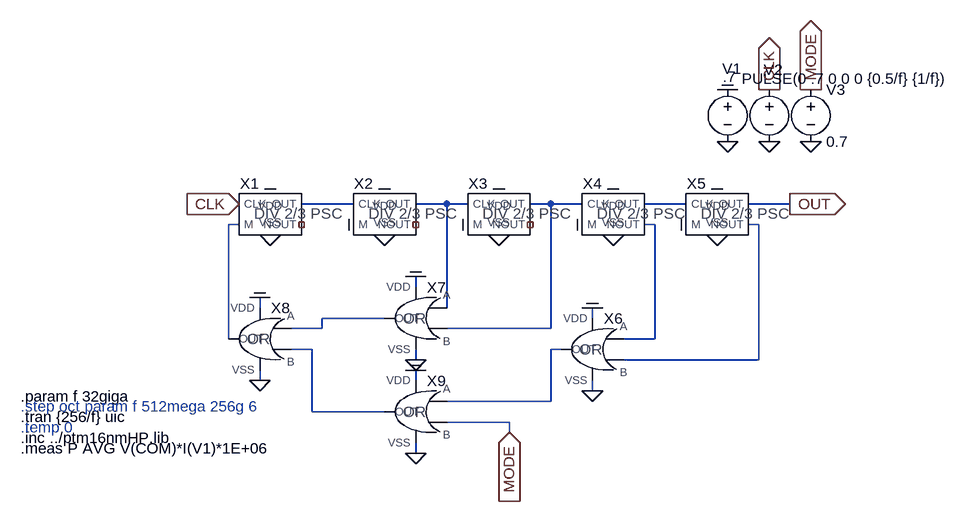
[diagram p0: schematic Full_Design.asc]
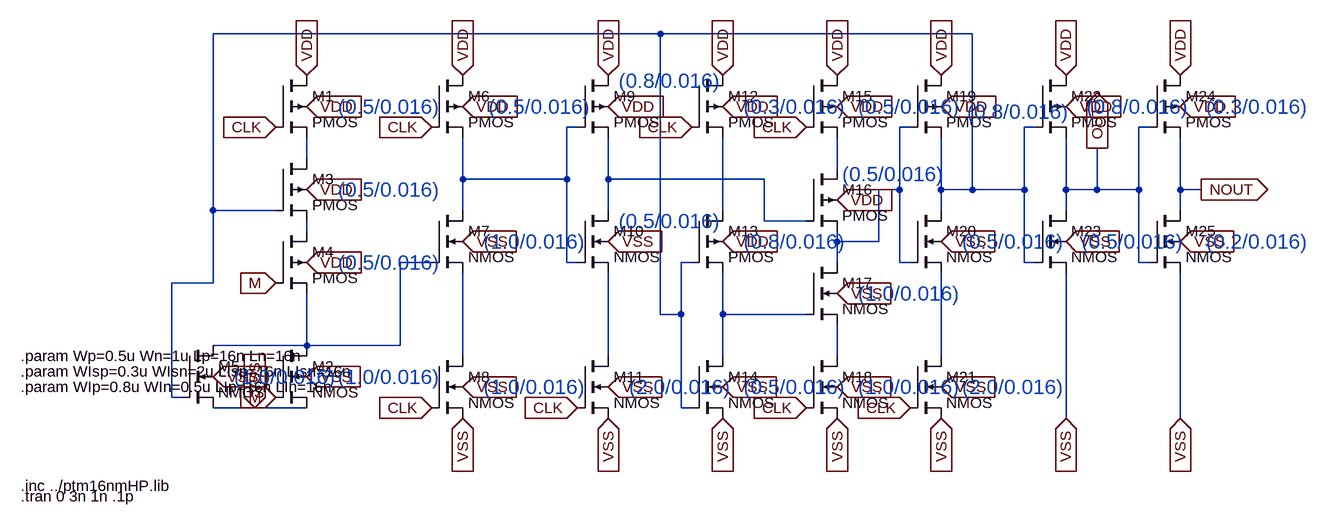
[diagram p1: sub-circuit tspc_33ghz_2by3psc.asc]
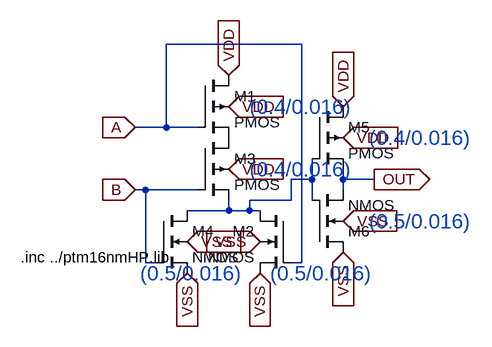
[diagram p2: sub-circuit logic_or_ccmos.asc]
Full_Design.asc, the LTspice schematic file:
Version 4
SHEET 1 1024 764
WIRE 160 80 80 80
WIRE 304 80 256 80
WIRE 336 80 304 80
WIRE 464 80 432 80
WIRE 512 80 464 80
WIRE 672 80 608 80
WIRE 832 80 768 80
WIRE -16 112 -32 112
WIRE 624 112 608 112
WIRE 784 112 768 112
WIRE 256 208 256 192
WIRE 16 240 16 224
WIRE 304 240 304 80
WIRE 208 256 112 256
WIRE 528 256 528 240
WIRE 112 272 112 256
WIRE 112 272 64 272
WIRE 464 272 464 80
WIRE 464 272 304 272
WIRE -32 288 -32 112
WIRE 624 288 624 112
WIRE 624 288 576 288
WIRE 96 304 64 304
WIRE 480 304 464 304
WIRE 256 320 256 304
WIRE 784 320 784 112
WIRE 784 320 576 320
WIRE 16 352 16 336
WIRE 256 352 256 336
WIRE 528 368 528 352
WIRE 464 384 464 304
WIRE 464 384 304 384
WIRE 96 400 96 304
WIRE 208 400 96 400
WIRE 400 416 304 416
WIRE 400 432 400 416
WIRE 256 464 256 448
FLAG 736 -16 0
FLAG 800 -16 0
FLAG 736 -96 COM
FLAG 32 64 COM
FLAG 208 64 COM
FLAG 384 64 COM
FLAG 32 128 0
FLAG 208 128 0
FLAG 384 128 0
FLAG -16 80 CLK
IOPIN -16 80 In
FLAG 800 -96 CLK
IOPIN 800 -96 Out
FLAG 560 128 0
FLAG 720 128 0
FLAG 672 112 COM
FLAG 560 64 COM
FLAG 720 64 COM
FLAG 512 112 COM
FLAG 336 112 COM
FLAG 160 112 COM
FLAG 832 80 OUT
IOPIN 832 80 Out
FLAG 864 -16 0
FLAG 864 -96 MODE
IOPIN 864 -96 Out
FLAG 256 192 COM
FLAG 16 224 COM
FLAG 528 240 COM
FLAG 256 336 COM
FLAG 16 352 0
FLAG 256 320 0
FLAG 528 368 0
FLAG 256 464 0
FLAG 400 432 MODE
IOPIN 400 432 In
SYMBOL TSPC_33GHz_2by3PSC 32 96 R0
SYMATTR InstName X1
SYMBOL TSPC_33GHz_2by3PSC 208 96 R0
SYMATTR InstName X2
SYMBOL TSPC_33GHz_2by3PSC 384 96 R0
SYMATTR InstName X3
SYMBOL voltage 736 -112 R0
WINDOW 0 -8 -16 Left 2
WINDOW 3 -7 -4 Left 2
SYMATTR InstName V1
SYMATTR Value .7
SYMBOL voltage 800 -112 R0
WINDOW 0 -8 -15 Left 2
WINDOW 3 -42 -1 Left 2
WINDOW 123 0 0 Left 0
WINDOW 39 0 0 Left 0
SYMATTR InstName V2
SYMATTR Value PULSE(0 .7 0 0 0 {0.5/f} {1/f})
SYMBOL TSPC_33GHz_2by3PSC 560 96 R0
SYMATTR InstName X4
SYMBOL TSPC_33GHz_2by3PSC 720 96 R0
SYMATTR InstName X5
SYMBOL voltage 864 -112 R0
SYMATTR InstName V3
SYMATTR Value 0.7
SYMBOL LOGIC_OR_cCMOS 544 304 M0
SYMATTR InstName X6
SYMBOL LOGIC_OR_cCMOS 272 256 M0
SYMATTR InstName X7
SYMBOL LOGIC_OR_cCMOS 32 288 M0
SYMATTR InstName X8
SYMBOL LOGIC_OR_cCMOS 272 400 M0
SYMATTR InstName X9
TEXT -352 440 Left 2 !.inc ../ptm16nmHP.lib
TEXT -352 408 Left 2 !.tran {256/f} uic
TEXT -352 424 Left 2 ;.temp 0
TEXT -352 376 Left 2 !.param f 32giga
TEXT -352 456 Left 2 !.meas P AVG V(COM)*I(V1)*1E+06
TEXT -352 392 Left 2 ;.step oct param f 512mega 256g 6

tspc_33ghz_2by3psc.asc, the sub-circuit schematic file:
Version 4
SHEET 1 1996 904
WIRE 752 -16 64 -16
WIRE 1232 -16 752 -16
WIRE 624 128 608 128
WIRE 1136 128 1120 128
WIRE 1328 128 1312 128
WIRE 1504 128 1488 128
WIRE 208 176 208 144
WIRE 1024 192 1024 144
WIRE 448 208 448 144
WIRE 608 208 608 128
WIRE 608 208 448 208
WIRE 672 208 672 144
WIRE 912 208 672 208
WIRE 1120 224 1120 128
WIRE 1120 224 1088 224
WIRE 1184 224 1184 144
WIRE 1232 224 1232 -16
WIRE 1232 224 1184 224
WIRE 1312 224 1312 128
WIRE 1312 224 1232 224
WIRE 1376 224 1376 144
WIRE 1424 224 1424 160
WIRE 1424 224 1376 224
WIRE 1488 224 1488 128
WIRE 1488 224 1424 224
WIRE 1552 224 1552 144
WIRE 1584 224 1552 224
WIRE 64 256 64 -16
WIRE 160 256 64 256
WIRE 448 256 448 208
WIRE 672 256 672 208
WIRE 848 256 848 144
WIRE 1184 256 1184 224
WIRE 1376 256 1376 224
WIRE 1552 256 1552 224
WIRE 912 272 912 208
WIRE 976 272 912 272
WIRE 208 288 208 272
WIRE 1024 304 1024 288
WIRE 1088 304 1088 224
WIRE 1088 304 1024 304
WIRE 400 336 352 336
WIRE 608 336 608 208
WIRE 624 336 608 336
WIRE 800 336 784 336
WIRE 1024 336 1024 304
WIRE 1120 336 1120 224
WIRE 1136 336 1120 336
WIRE 1312 336 1312 224
WIRE 1328 336 1312 336
WIRE 1488 336 1488 224
WIRE 1504 336 1488 336
WIRE 64 368 64 256
WIRE 64 368 0 368
WIRE 752 416 752 -16
WIRE 784 416 784 336
WIRE 784 416 752 416
WIRE 848 416 848 352
WIRE 976 416 848 416
WIRE 208 464 208 384
WIRE 208 464 64 464
WIRE 352 464 352 336
WIRE 352 464 208 464
WIRE 448 480 448 352
WIRE 672 480 672 352
WIRE 848 480 848 416
WIRE 1024 480 1024 432
WIRE 1184 480 1184 352
WIRE 0 544 0 368
WIRE 16 544 0 544
WIRE 128 560 64 560
WIRE 208 560 128 560
WIRE 784 560 784 416
WIRE 800 560 784 560
WIRE 1376 576 1376 352
WIRE 1552 576 1552 352
FLAG 208 96 VDD
IOPIN 208 96 In
FLAG 208 512 VSS
IOPIN 208 512 In
FLAG 208 48 VDD
IOPIN 208 48 In
FLAG 208 224 VDD
IOPIN 208 224 In
FLAG 208 336 VDD
IOPIN 208 336 In
FLAG 64 512 VSS
IOPIN 64 512 In
FLAG 448 96 VDD
IOPIN 448 96 In
FLAG 448 48 VDD
IOPIN 448 48 In
FLAG 448 304 VSS
IOPIN 448 304 In
FLAG 448 528 VSS
IOPIN 448 528 In
FLAG 672 96 VDD
IOPIN 672 96 In
FLAG 672 48 VDD
IOPIN 672 48 In
FLAG 672 304 VSS
IOPIN 672 304 In
FLAG 672 528 VSS
IOPIN 672 528 In
FLAG 848 96 VDD
IOPIN 848 96 In
FLAG 848 48 VDD
IOPIN 848 48 In
FLAG 848 304 VDD
IOPIN 848 304 In
FLAG 848 528 VSS
IOPIN 848 528 In
FLAG 1024 96 VDD
IOPIN 1024 96 In
FLAG 1024 48 VDD
IOPIN 1024 48 In
FLAG 1024 240 VDD
IOPIN 1024 240 In
FLAG 1024 384 VSS
IOPIN 1024 384 In
FLAG 1024 528 VSS
IOPIN 1024 528 In
FLAG 1184 96 VDD
IOPIN 1184 96 In
FLAG 1184 48 VDD
IOPIN 1184 48 In
FLAG 1184 304 VSS
IOPIN 1184 304 In
FLAG 1184 528 VSS
IOPIN 1184 528 In
FLAG 128 560 VSS
IOPIN 128 560 In
FLAG 448 576 VSS
IOPIN 448 576 In
FLAG 672 576 VSS
IOPIN 672 576 In
FLAG 848 576 VSS
IOPIN 848 576 In
FLAG 1024 576 VSS
IOPIN 1024 576 In
FLAG 1184 576 VSS
IOPIN 1184 576 In
FLAG 624 560 CLK
IOPIN 624 560 In
FLAG 800 128 CLK
IOPIN 800 128 In
FLAG 976 128 CLK
IOPIN 976 128 In
FLAG 976 560 CLK
IOPIN 976 560 In
FLAG 1136 560 CLK
IOPIN 1136 560 In
FLAG 400 128 CLK
IOPIN 400 128 In
FLAG 400 560 CLK
IOPIN 400 560 In
FLAG 160 128 CLK
IOPIN 160 128 In
FLAG 160 368 M
IOPIN 160 368 In
FLAG 160 544 M
IOPIN 160 544 In
FLAG 1376 96 VDD
IOPIN 1376 96 In
FLAG 1376 48 VDD
IOPIN 1376 48 In
FLAG 1376 304 VSS
IOPIN 1376 304 In
FLAG 1376 576 VSS
IOPIN 1376 576 In
FLAG 1424 160 OUT
IOPIN 1424 160 Out
FLAG 1552 96 VDD
IOPIN 1552 96 In
FLAG 1552 304 VSS
IOPIN 1552 304 In
FLAG 1584 224 NOUT
IOPIN 1584 224 Out
FLAG 1552 576 VSS
IOPIN 1552 576 In
FLAG 1552 48 VDD
IOPIN 1552 48 In
SYMBOL pmos4 160 48 R0
SYMATTR InstName M1
SYMATTR Value2 l={Lp} w={Wp}
SYMBOL nmos4 160 464 R0
SYMATTR InstName M2
SYMATTR Value2 l={Ln} w={Wn}
SYMBOL pmos4 160 176 R0
SYMATTR InstName M3
SYMATTR Value2 l={Lp} w={Wp}
SYMBOL pmos4 160 288 R0
SYMATTR InstName M4
SYMATTR Value2 l={Lp} w={Wp}
SYMBOL nmos4 16 464 R0
SYMATTR InstName M5
SYMATTR Value2 l={Ln} w={Wn}
SYMBOL pmos4 400 48 R0
SYMATTR InstName M6
SYMATTR Value2 l={Lp} w={Wp}
SYMBOL nmos4 400 256 R0
SYMATTR InstName M7
SYMATTR Value2 l={Ln} w={Wn}
SYMBOL nmos4 400 480 R0
SYMATTR InstName M8
SYMATTR Value2 l={Ln} w={Wn}
SYMBOL pmos4 624 48 R0
SYMATTR InstName M9
SYMATTR Value2 l={LIp} w={WIp}
SYMBOL nmos4 624 256 R0
SYMATTR InstName M10
SYMATTR Value2 l={LIn} w={WIn}
SYMBOL nmos4 624 480 R0
SYMATTR InstName M11
SYMATTR Value2 l={LIsn} w={WIsn}
SYMBOL pmos4 800 48 R0
SYMATTR InstName M12
SYMATTR Value2 l={LIsp} w={WIsp}
SYMBOL pmos4 800 256 R0
SYMATTR InstName M13
SYMATTR Value2 l={LIp} w={WIp}
SYMBOL nmos4 800 480 R0
SYMATTR InstName M14
SYMATTR Value2 l={LIn} w={WIn}
SYMBOL pmos4 976 48 R0
SYMATTR InstName M15
SYMATTR Value2 l={Lp} w={Wp}
SYMBOL pmos4 976 192 R0
SYMATTR InstName M16
SYMATTR Value2 l={Lp} w={Wp}
SYMBOL nmos4 976 336 R0
SYMATTR InstName M17
SYMATTR Value2 l={Ln} w={Wn}
SYMBOL nmos4 976 480 R0
SYMATTR InstName M18
SYMATTR Value2 l={Ln} w={Wn}
SYMBOL pmos4 1136 48 R0
SYMATTR InstName M19
SYMATTR Value2 l={LIp} w={WIp}
SYMBOL nmos4 1136 256 R0
SYMATTR InstName M20
SYMATTR Value2 l={LIn} w={WIn}
SYMBOL nmos4 1136 480 R0
SYMATTR InstName M21
SYMATTR Value2 l={LIsn} w={WIsn}
SYMBOL pmos4 1328 48 R0
SYMATTR InstName M22
SYMATTR Value2 l={LIp} w={WIp}
SYMBOL nmos4 1328 256 R0
SYMATTR InstName M23
SYMATTR Value2 l={LIn} w={WIn}
SYMBOL pmos4 1504 48 R0
SYMATTR InstName M24
SYMATTR Value2 l={LIp} w=0.3u
SYMBOL nmos4 1504 256 R0
SYMATTR InstName M25
SYMATTR Value2 l={LIn} w=0.2u
TEXT -232 680 Left 2 !.inc ../ptm16nmHP.lib
TEXT -232 480 Left 2 !.param Wp=0.5u Wn=1u Lp=16n Ln=16n
TEXT -232 504 Left 2 !.param WIsp=0.3u WIsn=2u LIsp=16n LIsn=16n
TEXT -232 528 Left 2 !.param WIp=0.8u WIn=0.5u LIp=16n LIn=16n
TEXT -232 696 Left 2 !.tran 0 3n 1n .1p
TEXT 256 96 Left 3 ;(0.5/0.016)
TEXT 256 224 Left 3 ;(0.5/0.016)
TEXT 256 336 Left 3 ;(0.5/0.016)
TEXT 256 512 Left 3 ;(1.0/0.016)
TEXT 96 512 Left 3 ;(1.0/0.016)
TEXT 488 96 Left 3 ;(0.5/0.016)
TEXT 688 56 Left 3 ;(0.8/0.016)
TEXT 688 272 Left 3 ;(0.5/0.016)
TEXT 704 528 Left 3 ;(2.0/0.016)
TEXT 880 528 Left 3 ;(0.5/0.016)
TEXT 880 304 Left 3 ;(0.8/0.016)
TEXT 880 96 Left 3 ;(0.3/0.016)
TEXT 1056 96 Left 3 ;(0.5/0.016)
TEXT 1032 200 Left 3 ;(0.5/0.016)
TEXT 1056 528 Left 3 ;(1.0/0.016)
TEXT 1216 528 Left 3 ;(2.0/0.016)
TEXT 1216 304 Left 3 ;(0.5/0.016)
TEXT 1224 104 Left 3 ;(0.8/0.016)
TEXT 1400 304 Left 3 ;(0.5/0.016)
TEXT 1592 304 Left 3 ;(0.2/0.016)
TEXT 1592 96 Left 3 ;(0.3/0.016)
TEXT 480 528 Left 3 ;(1.0/0.016)
TEXT 480 304 Left 3 ;(1.0/0.016)
TEXT 1056 384 Left 3 ;(1.0/0.016)
TEXT 1408 96 Left 3 ;(0.8/0.016)

logic_or_ccmos.asc, the sub-circuit schematic file:
Version 4
SHEET 1 880 680
WIRE 240 -32 32 -32
WIRE 32 96 32 -32
WIRE 32 96 -16 96
WIRE 80 96 32 96
WIRE 256 176 256 144
WIRE 256 176 224 176
WIRE 304 176 304 160
WIRE 352 176 304 176
WIRE 0 192 -16 192
WIRE 80 192 0 192
WIRE 304 192 304 176
WIRE 224 208 224 176
WIRE 224 208 160 208
WIRE 256 208 256 176
WIRE 128 224 128 208
WIRE 128 224 64 224
WIRE 160 224 160 208
WIRE 160 224 128 224
WIRE 176 224 160 224
WIRE 0 304 0 192
WIRE 16 304 0 304
WIRE 240 304 240 -32
WIRE 240 304 224 304
FLAG 128 16 VDD
IOPIN 128 16 In
FLAG 128 64 VDD
IOPIN 128 64 In
FLAG 128 160 VDD
IOPIN 128 160 In
FLAG 176 272 VSS
IOPIN 176 272 In
FLAG 64 272 VSS
IOPIN 64 272 In
FLAG 64 320 VSS
IOPIN 64 320 In
FLAG 176 320 VSS
IOPIN 176 320 In
FLAG -16 96 A
IOPIN -16 96 In
FLAG -16 192 B
IOPIN -16 192 In
FLAG 352 176 OUT
IOPIN 352 176 Out
FLAG 304 64 VDD
IOPIN 304 64 In
FLAG 304 112 VDD
IOPIN 304 112 In
FLAG 304 240 VSS
IOPIN 304 240 In
FLAG 304 288 VSS
IOPIN 304 288 In
SYMBOL pmos4 80 16 R0
SYMATTR InstName M1
SYMATTR Value2 l=16n w=400n
SYMBOL nmos4 224 224 M0
SYMATTR InstName M2
SYMATTR Value2 l=16n w=500n
SYMBOL pmos4 80 112 R0
SYMATTR InstName M3
SYMATTR Value2 l=16n w=400n
SYMBOL nmos4 16 224 R0
SYMATTR InstName M4
SYMATTR Value2 l=16n w=500n
SYMBOL pmos4 256 64 R0
SYMATTR InstName M5
SYMATTR Value2 l=16n w=400n
SYMBOL nmos4 256 288 M180
SYMATTR InstName M6
SYMATTR Value2 l=16n w=500n
TEXT -192 296 Left 2 !.inc ../ptm16nmHP.lib
TEXT 160 64 Left 3 ;(0.4/0.016)
TEXT 160 160 Left 3 ;(0.4/0.016)
TEXT 344 112 Left 3 ;(0.4/0.016)
TEXT 344 240 Left 3 ;(0.5/0.016)
TEXT -8 320 Left 3 ;(0.5/0.016)
TEXT 192 320 Left 3 ;(0.5/0.016)

The netlist it stands for:
* Full_Design.asc
XX1 CLK N005 COM 0 N001 NC_01 tspc_33ghz_2by3psc
XX2 N001 COM COM 0 N002 NC_02 tspc_33ghz_2by3psc
XX3 N002 COM COM 0 N003 NC_03 tspc_33ghz_2by3psc
V1 COM 0 .7
V2 CLK 0 PULSE(0 .7 0 0 0 {0.5/f} {1/f})
XX4 N003 COM COM 0 N004 N006 tspc_33ghz_2by3psc
XX5 N004 COM COM 0 OUT N007 tspc_33ghz_2by3psc
V3 MODE 0 0.7
XX6 N006 N007 COM 0 N010 logic_or_ccmos
XX7 N002 N003 COM 0 N008 logic_or_ccmos
XX8 N008 N009 COM 0 N005 logic_or_ccmos
XX9 N010 MODE COM 0 N009 logic_or_ccmos

* block symbol definitions
.subckt tspc_33ghz_2by3psc CLK M VDD VSS OUT NOUT
M1 VDD CLK N004 VDD PMOS l={Lp} w={Wp}
M2 N009 M VSS VSS NMOS l={Ln} w={Wn}
M3 N004 N001 N008 VDD PMOS l={Lp} w={Wp}
M4 N008 M N009 VDD PMOS l={Lp} w={Wp}
M5 N009 N001 VSS VSS NMOS l={Ln} w={Wn}
M6 VDD CLK N002 VDD PMOS l={Lp} w={Wp}
M7 N002 N009 N011 VSS NMOS l={Ln} w={Wn}
M8 N011 CLK VSS VSS NMOS l={Ln} w={Wn}
M9 VDD N002 N006 VDD PMOS l={LIp} w={WIp}
M10 N006 N002 N012 VSS NMOS l={LIn} w={WIn}
M11 N012 CLK VSS VSS NMOS l={LIsn} w={WIsn}
M12 VDD CLK N007 VDD PMOS l={LIsp} w={WIsp}
M13 N007 N001 N010 VDD PMOS l={LIp} w={WIp}
M14 N010 N001 VSS VSS NMOS l={LIn} w={WIn}
M15 VDD CLK N005 VDD PMOS l={Lp} w={Wp}
M16 N005 N006 N003 VDD PMOS l={Lp} w={Wp}
M17 N003 N010 N013 VSS NMOS l={Ln} w={Wn}
M18 N013 CLK VSS VSS NMOS l={Ln} w={Wn}
M19 VDD N003 N001 VDD PMOS l={LIp} w={WIp}
M20 N001 N003 N014 VSS NMOS l={LIn} w={WIn}
M21 N014 CLK VSS VSS NMOS l={LIsn} w={WIsn}
M22 VDD N001 OUT VDD PMOS l={LIp} w={WIp}
M23 OUT N001 VSS VSS NMOS l={LIn} w={WIn}
M24 VDD OUT NOUT VDD PMOS l={LIp} w=0.3u
M25 NOUT OUT VSS VSS NMOS l={LIn} w=0.2u
.inc ../ptm16nmHP.lib
.param Wp=0.5u Wn=1u Lp=16n Ln=16n
.param WIsp=0.3u WIsn=2u LIsp=16n LIsn=16n
.param WIp=0.8u WIn=0.5u LIp=16n LIn=16n
.tran 0 3n 1n .1p
* (0.5/0.016)
* (0.5/0.016)
* (0.5/0.016)
* (1.0/0.016)
* (1.0/0.016)
* (0.5/0.016)
* (0.8/0.016)
* (0.5/0.016)
* (2.0/0.016)
* (0.5/0.016)
* (0.8/0.016)
* (0.3/0.016)
* (0.5/0.016)
* (0.5/0.016)
* (1.0/0.016)
* (2.0/0.016)
* (0.5/0.016)
* (0.8/0.016)
* (0.5/0.016)
* (0.2/0.016)
* (0.3/0.016)
* (1.0/0.016)
* (1.0/0.016)
* (1.0/0.016)
* (0.8/0.016)
.ends tspc_33ghz_2by3psc

.subckt logic_or_ccmos A B VDD VSS OUT
M1 VDD A P001 VDD PMOS l=16n w=400n
M2 N001 A VSS VSS NMOS l=16n w=500n
M3 P001 B N001 VDD PMOS l=16n w=400n
M4 N001 B VSS VSS NMOS l=16n w=500n
M5 VDD N001 OUT VDD PMOS l=16n w=400n
M6 VSS N001 OUT VSS NMOS l=16n w=500n
.inc ../ptm16nmHP.lib
* (0.4/0.016)
* (0.4/0.016)
* (0.4/0.016)
* (0.5/0.016)
* (0.5/0.016)
* (0.5/0.016)
.ends logic_or_ccmos

.model NMOS NMOS
.model PMOS PMOS
.lib standard.mos
.inc ../ptm16nmHP.lib
.tran {256/f} uic
* .temp 0
.param f 32giga
.meas P AVG V(COM)*I(V1)*1E+06
* .step oct param f 512mega 256g 6
.backanno
.end